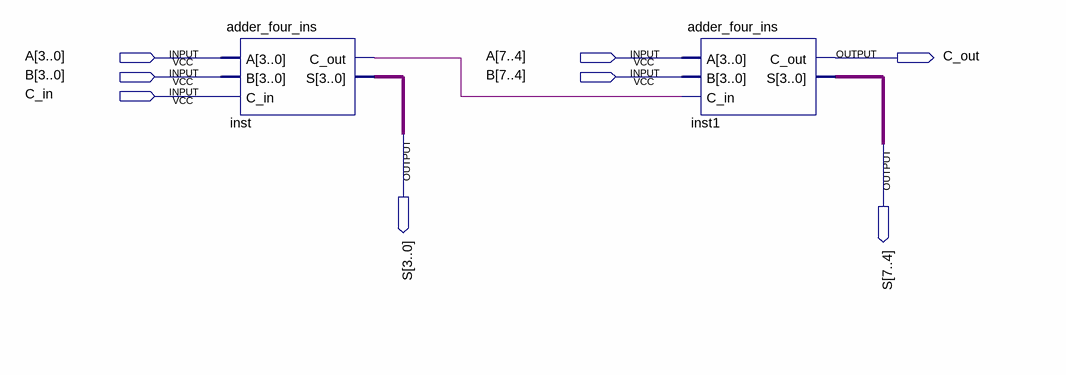
[diagram p0: schematic sheet]
// Quartus schematic adder_8bit_CAS.bdf as structural Verilog: 2 symbols, 8 pins
module adder_8bit_CAS (
  input  [7:0] A,
  input  [7:0] B,
  input  C_in,
  output C_out,
  output [7:0] S
);

  wire inst_c_out;

  adder_four_ins inst (.A(A[3:0]), .B(B[3:0]), .C_in(C_in), .C_out(inst_c_out), .S(S[3:0]));
  adder_four_ins inst1 (.A(A[7:4]), .B(B[7:4]), .C_in(inst_c_out), .C_out(C_out), .S(S[7:4]));
endmodule
